# EAGLE design scheme (EAGLE 6.5.0)
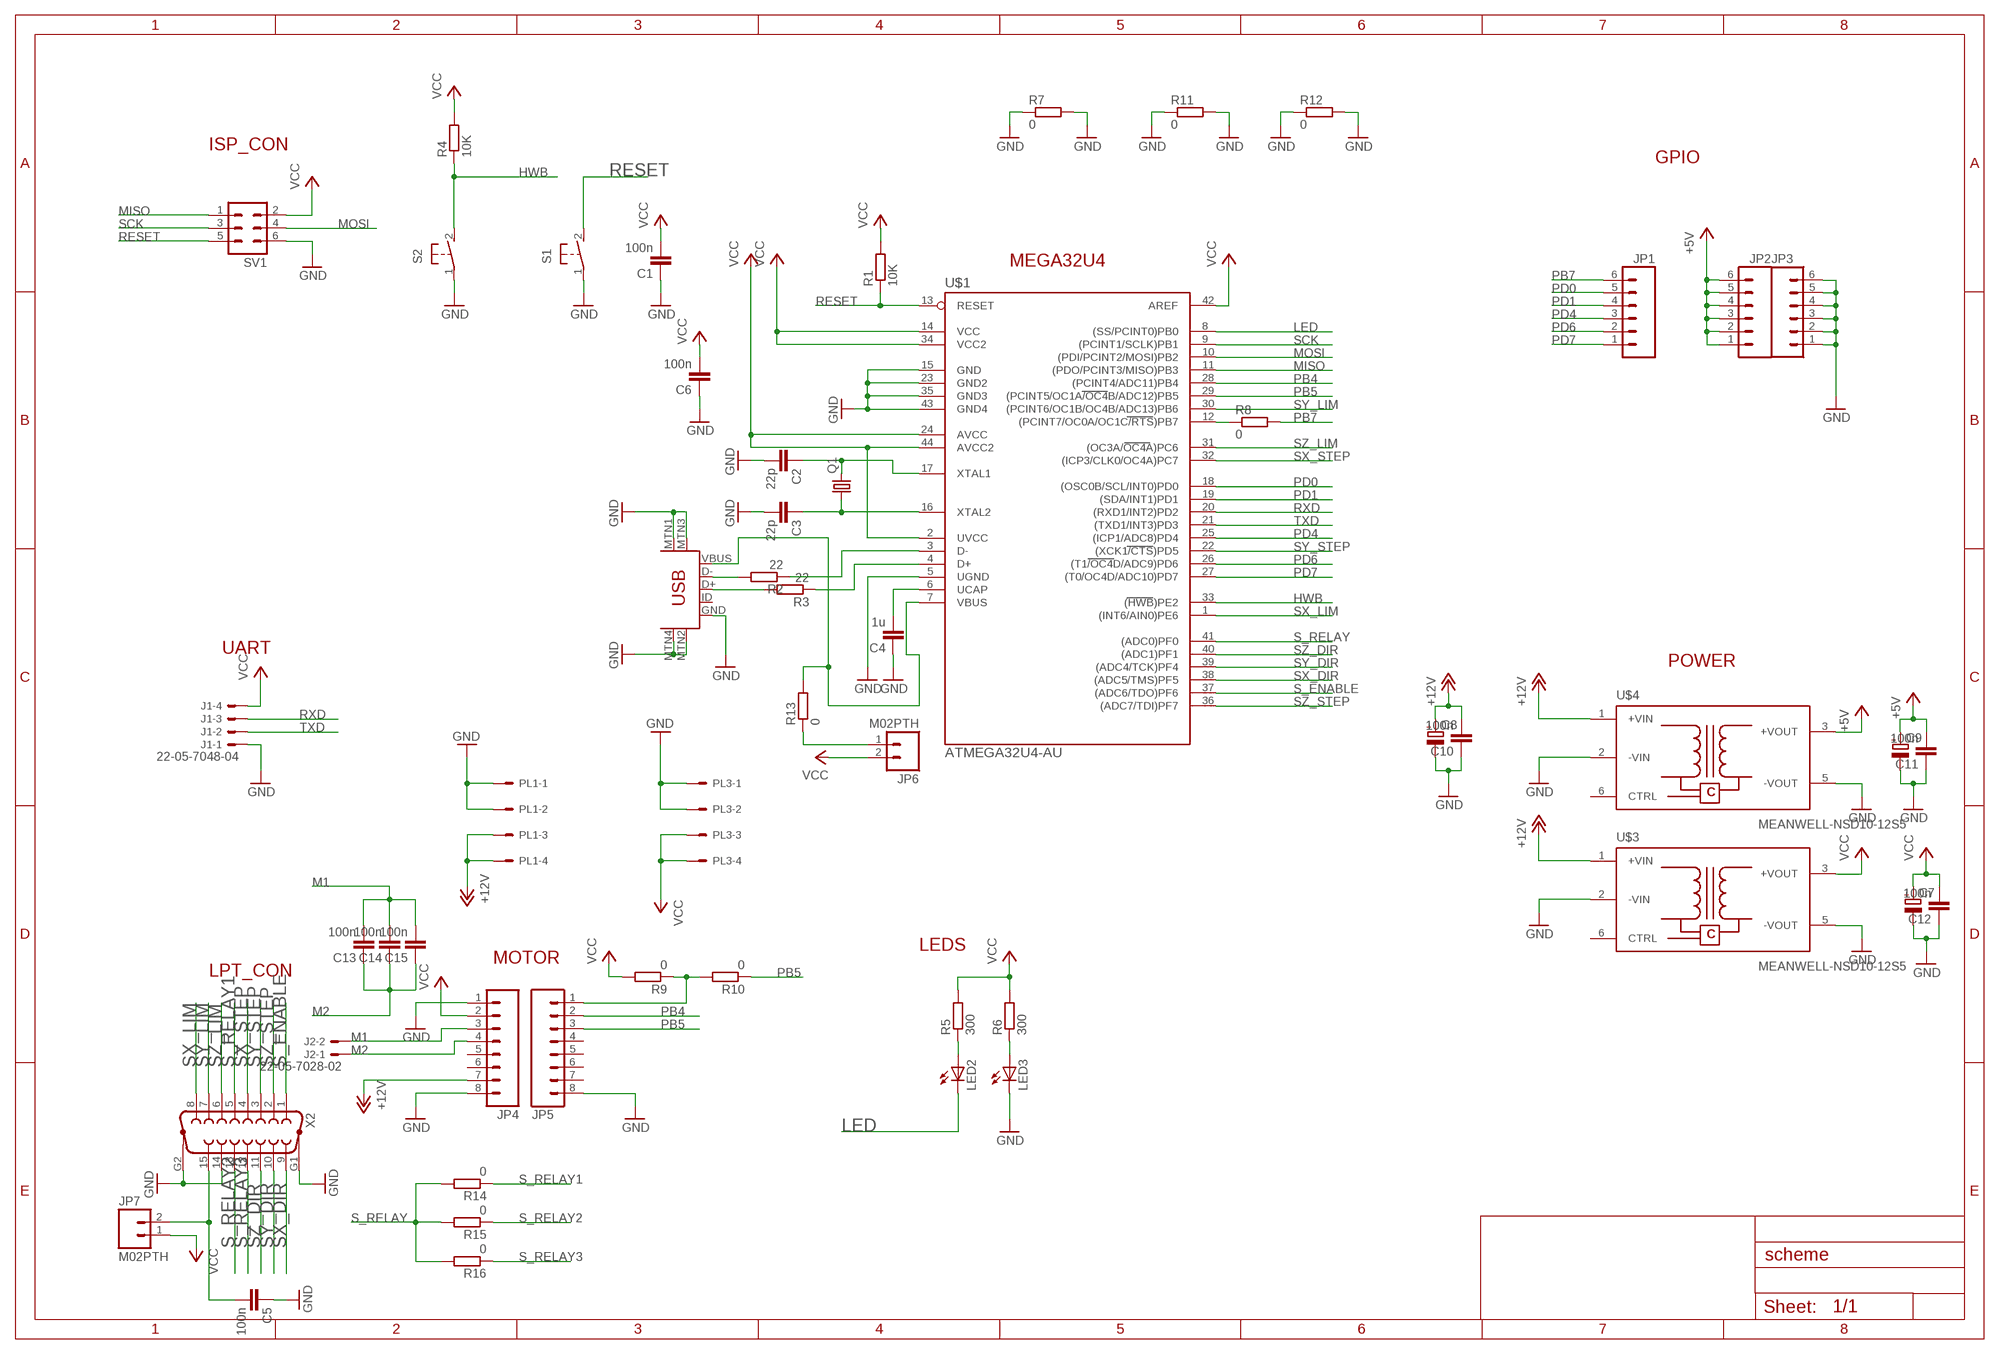
[diagram p0: schematic, sheet 1]

## Parts
C1  100n  C-EUC0805  [C0805]
C2  22p  C-EUC0805  [C0805]
C3  22p  C-EUC0805  [C0805]
C4  1u  C-EUC0805  [C0805]
C5  100n  C-EUC0805  [C0805]
C6  100n  C-EUC0805  [C0805]
C7  CPOL-EUE2.5-6  [E2,5-6]
C8  CPOL-EUE2.5-6  [E2,5-6]
C9  CPOL-EUE2.5-6  [E2,5-6]
C10  100n  C-EUC0805  [C0805]
C11  100n  C-EUC0805  [C0805]
C12  100n  C-EUC0805  [C0805]
C13  100n  C-EUC0805  [C0805]
C14  100n  C-EUC0805  [C0805]
C15  100n  C-EUC0805  [C0805]
J1  22-05-7048-04  [7395-04]
J2  22-05-7028-02  [7395-02]
JP1  M06SIP  [1X06]
JP2  M06SIP  [1X06]
JP3  M06SIP  [1X06]
JP4  M081X08  [1X08]
JP5  M081X08  [1X08]
JP6  M02PTH  [1X02]
JP7  M02PTH  [1X02]
LED2  LED5MM  [LED5MM]
LED3  LED5MM  [LED5MM]
PL1  555X-4H  [5569-4]
PL3  555X-4H  [5569-4]
Q1  CRYSTALHC49S  [HC49/S]
R1  10K  R-EU_R0805  [R0805]
R2  22  R-EU_R0805  [R0805]
R3  22  R-EU_R0805  [R0805]
R4  10K  R-EU_R0805  [R0805]
R5  300  R-EU_R0805  [R0805]
R6  300  R-EU_R0805  [R0805]
R7  0  R-EU_R1206  [R1206]
R8  0  R-EU_R1206  [R1206]
R9  0  R-EU_R0805  [R0805]
R10  0  R-EU_R0805  [R0805]
R11  0  R-EU_R1206  [R1206]
R12  0  R-EU_R1206  [R1206]
R13  0  R-EU_R1206  [R1206]
R14  0  R-EU_R0805  [R0805]
R15  0  R-EU_R0805  [R0805]
R16  0  R-EU_R0805  [R0805]
S1  31-XX  [B3F-31XX]
S2  31-XX  [B3F-31XX]
SV1  ML6L  [ML6L]
U$1  ATMEGA32U4-AU  [TQFP44]
U$2  USB-MINIB-5PIN  [USB-MINIB]
U$3  MEANWELL-NSD10-12S5  [POWER6-10W]
U$4  MEANWELL-NSD10-12S5  [POWER6-10W]
X2  F15HP  [F15HP]

## Nets
+5V: C9.+ C11.2 JP2.1 JP2.2 JP2.3 JP2.4 JP2.5 JP2.6 U$4.3(+VOUT)
+12V: C8.+ C10.2 JP4.7 PL1.3 PL1.4 U$3.1(+VIN) U$4.1(+VIN)
GND: C1.1 C2.2 C3.2 C4.1 C5.1 C6.1 C7.- C8.- C9.- C10.1 C11.1 C12.1 J1.1 JP3.1 JP3.2 JP3.3 JP3.4 JP3.5 JP3.6 JP4.1 JP4.8 JP5.8 LED3.K(C) PL1.1 PL1.2 PL3.1 PL3.2 R7.1 R7.2 R11.1 R11.2 R12.1 R12.2 S1.1(P) S2.1(P) SV1.6 U$1.5(UGND) U$1.15(GND) U$1.23(GND2) U$1.35(GND3) U$1.43(GND4) U$2.GND U$2.MTN1(MTN2) U$2.MTN2(MTN3) U$2.MTN3(MTN1) U$2.MTN4 U$3.2(-VIN) U$3.5(-VOUT) U$4.2(-VIN) U$4.5(-VOUT) X2.14 X2.G1 X2.G2
HWB: R4.1 S2.2(S) U$1.33((HWB)PE2)
LED: LED2.K(C) U$1.8((SS/PCINT0)PB0)
M1: C13.2 C14.2 C15.2 J2.2 JP4.3
M2: C13.1 C14.1 C15.1 J2.1 JP4.4
MISO: SV1.1 U$1.11((PDO/PCINT3/MISO)PB3)
MOSI: SV1.4 U$1.10((PDI/PCINT2/MOSI)PB2)
N$1: C3.1 Q1.1 U$1.16(XTAL2)
N$2: C2.1 Q1.2 U$1.17(XTAL1)
N$3: LED3.A R6.1
N$4: R3.2 U$2.D+
N$5: R8.1 U$1.12((PCINT7/OC0A/OC1C/RTS)PB7)
N$6: R2.2 U$2.D-
N$7: R2.1 U$1.3(D-)
N$8: R3.1 U$1.4(D+)
N$10: C4.2 U$1.6(UCAP)
N$11: R13.2 U$1.7(VBUS) U$2.VBUS
N$12: JP6.1 R13.1
N$13: LED2.A R5.1
N$16: C5.2 JP7.2 X2.15
N$17: JP5.1 R9.1 R10.2
PB4: JP5.2 U$1.28((PCINT4/ADC11)PB4)
PB5: JP5.3 R10.1 U$1.29((PCINT5/OC1A/OC4B/ADC12)PB5)
PB7: JP1.6 R8.2
PD0: JP1.5 U$1.18((OSC0B/SCL/INT0)PD0)
PD1: JP1.4 U$1.19((SDA/INT1)PD1)
PD4: JP1.3 U$1.25((ICP1/ADC8)PD4)
PD6: JP1.2 U$1.26((T1/OC4D/ADC9)PD6)
PD7: JP1.1 U$1.27((T0/OC4D/ADC10)PD7)
RESET: R1.1 S1.2(S) SV1.5 U$1.13(RESET)
RXD: J1.3 U$1.20((RXD1/INT2)PD2)
S_ENABLE: U$1.37((ADC6/TDO)PF6) X2.1
S_RELAY: R14.2 R15.2 R16.2 U$1.41((ADC0)PF0)
S_RELAY1: R14.1 X2.5
S_RELAY2: R15.1 X2.13
S_RELAY3: R16.1 X2.12
SCK: SV1.3 U$1.9((PCINT1/SCLK)PB1)
SX_DIR: U$1.38((ADC5/TMS)PF5) X2.9
SX_LIM: U$1.1((INT6/AIN0)PE6) X2.8
SX_STEP: U$1.32((ICP3/CLK0/OC4A)PC7) X2.4
SY_DIR: U$1.39((ADC4/TCK)PF4) X2.10
SY_LIM: U$1.30((PCINT6/OC1B/OC4B/ADC13)PB6) X2.7
SY_STEP: U$1.22((XCK1/CTS)PD5) X2.3
SZ_DIR: U$1.40((ADC1)PF1) X2.11
SZ_LIM: U$1.31((OC3A/OC4A)PC6) X2.6
SZ_STEP: U$1.36((ADC7/TDI)PF7) X2.2
TXD: J1.2 U$1.21((TXD1/INT3)PD3)
VCC: C1.2 C6.2 C7.+ C12.2 J1.4 JP4.2 JP6.2 JP7.1 PL3.3 PL3.4 R1.2 R4.2 R5.2 R6.2 R9.2 SV1.2 U$1.2(UVCC) U$1.14(VCC) U$1.24(AVCC) U$1.34(VCC2) U$1.42(AREF) U$1.44(AVCC2) U$3.3(+VOUT)
Unconnected: JP4.5 JP4.6 JP5.4 JP5.5 JP5.6 JP5.7 U$2.ID U$3.6(CTRL) U$4.6(CTRL)

## Notes on the sheet
- ISP_CON
- GPIO
- MEGA32U4
- UART
- POWER
- LEDS
- MOTOR
- LPT_CON

## Library data of the parts
C1-C6 C10-C15 = resistor:C-EU: CAPACITOR, European symbol
C7-C9 = rcl:CPOL-EU: POLARIZED CAPACITOR, European symbol
J1 = con-molex:22-?-04: CONNECTOR wire to board 2.54 mm (.1 inch) pitch header; OC_FARNELL: unknown; OC_NEWARK: unknown
J2 = con-molex:22-?-02: CONNECTOR wire to board 2.54 mm (.1 inch) pitch header; OC_FARNELL: 9731601; OC_NEWARK: unknown
JP1-JP3 = SparkFun-Connectors:M06: Header 6 Standard 6-pin 0.1" header. Use with straight break away headers (SKU : PRT-00116), right angle break away headers (PRT-00553), swiss pins (PRT-00743), machine pins (PRT-00117), and female headers (PRT-00115). Molex polarized connector foot print use with SKU : PRT-08094 with associated crimp pins and housings. NOTES ON THE VARIANTS LOCK and LOCK_LONGPADS... This footprint was designed to help hold the alignment of a through-hole component (i.e. 6-pin header) while soldering it into place. You may notice that each hole has been shifted either up or down by 0.005 of an inch from it's more standard position (which is a perfectly straight line). This slight alteration caused the pins (the squares in the middle) to touch the edges of the holes. Because they are alternating, it causes a "brace" to hold the component in place. 0.005 has proven to be the perfect amount of "off-center" position when using our standard breakaway headers. Although looks a little odd when you look at the bare footprint, once you have a header in there, the alteration is very hard to notice. Also,if you push a header all the way into place, it is covered up entirely on the bottom side. This idea of altering the position of holes to aid alignment will be further integrated into the Sparkfun Library for other footprints. It can help hold any component with 3 or more connection pins.
JP4 JP5 = SparkFun-Connectors:M08: Header 8 Standard 8-pin 0.1" header. Use with straight break away headers (SKU : PRT-00116), right angle break away headers (PRT-00553), swiss pins (PRT-00743), machine pins (PRT-00117), and female headers (PRT-00115).
JP6 JP7 = SparkFun-Connectors:M02: Standard 2-pin 0.1" header. Use with - straight break away headers ( PRT-00116) - right angle break away headers (PRT-00553) - swiss pins (PRT-00743) - machine pins (PRT-00117) - female headers (PRT-00115) Molex polarized connector foot print use with: PRT-08233 with associated crimp pins and housings. 2.54_SCREWTERM for use with PRT-10571. 3.5mm Screw Terminal footprints for PRT-08084 5mm Screw Terminal footprints for use with PRT-08433
LED2 LED3 = SparkFun-LED:LED: LEDs Standard schematic elements and footprints for 5mm, 3mm, 1206, and 0603 sized LEDs. 5mm - Spark Fun Electronics SKU : COM-00529 (and others)
PL1 PL3 = con-molex-2:555X-4: Mini FIT connector 4 way
Q1 = adafruit:CRYSTAL: CRYSTAL; OC_FARNELL: 1667008; OC_NEWARK: unknown
R1-R6 R9 R10 R14-R16 = resistor:R-EU_: RESISTOR, European symbol
R7 R8 R11-R13 = rcl:R-EU_: RESISTOR, European symbol
S1 S2 = switch-omron:31-XX: OMRON SWITCH; MPN: B3F-3100; OC_FARNELL: 959704; OC_NEWARK: 36M3582
SV1 = con-ml:ML6L: HARTING; OC_FARNELL: unknown; OC_NEWARK: unknown
U$1 = mega32U4:ATMEGA32U4-AU
U$2 = SparkFun-Connectors:USB-MINIB: Mini-USB "B" connector with 5th pin broken out. Created new symbol breaking out 5th "ID" pin in mini/micro USB connector spec. See: http://en.wikipedia.org/wiki/Mini_usb#Cables. Uses same footprint as 4-pin symbol. Also added pins to connect to mounting / shield pads if required (probably not generally needed as signals aren't shielded once they leave the connector).
U$3 U$4 = dimrobotics:MEANWELL-NSD10-
X2 = con-subd:F15HP: SUB-D; OC_FARNELL: unknown; OC_NEWARK: unknown

## Board
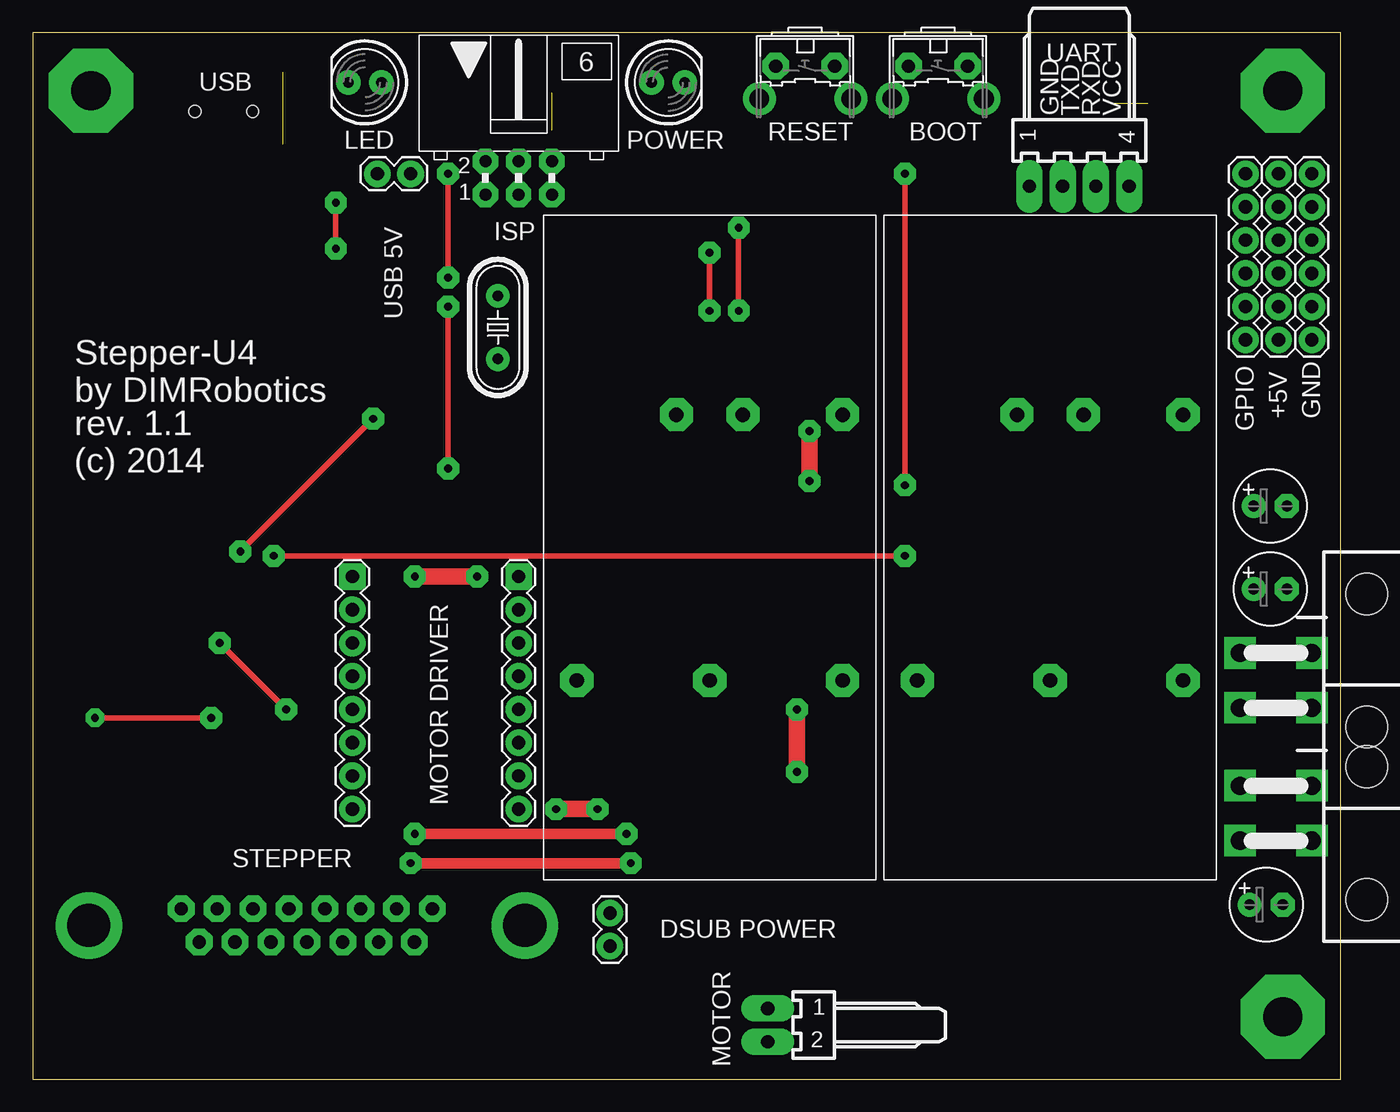
[diagram p1: board, top side]
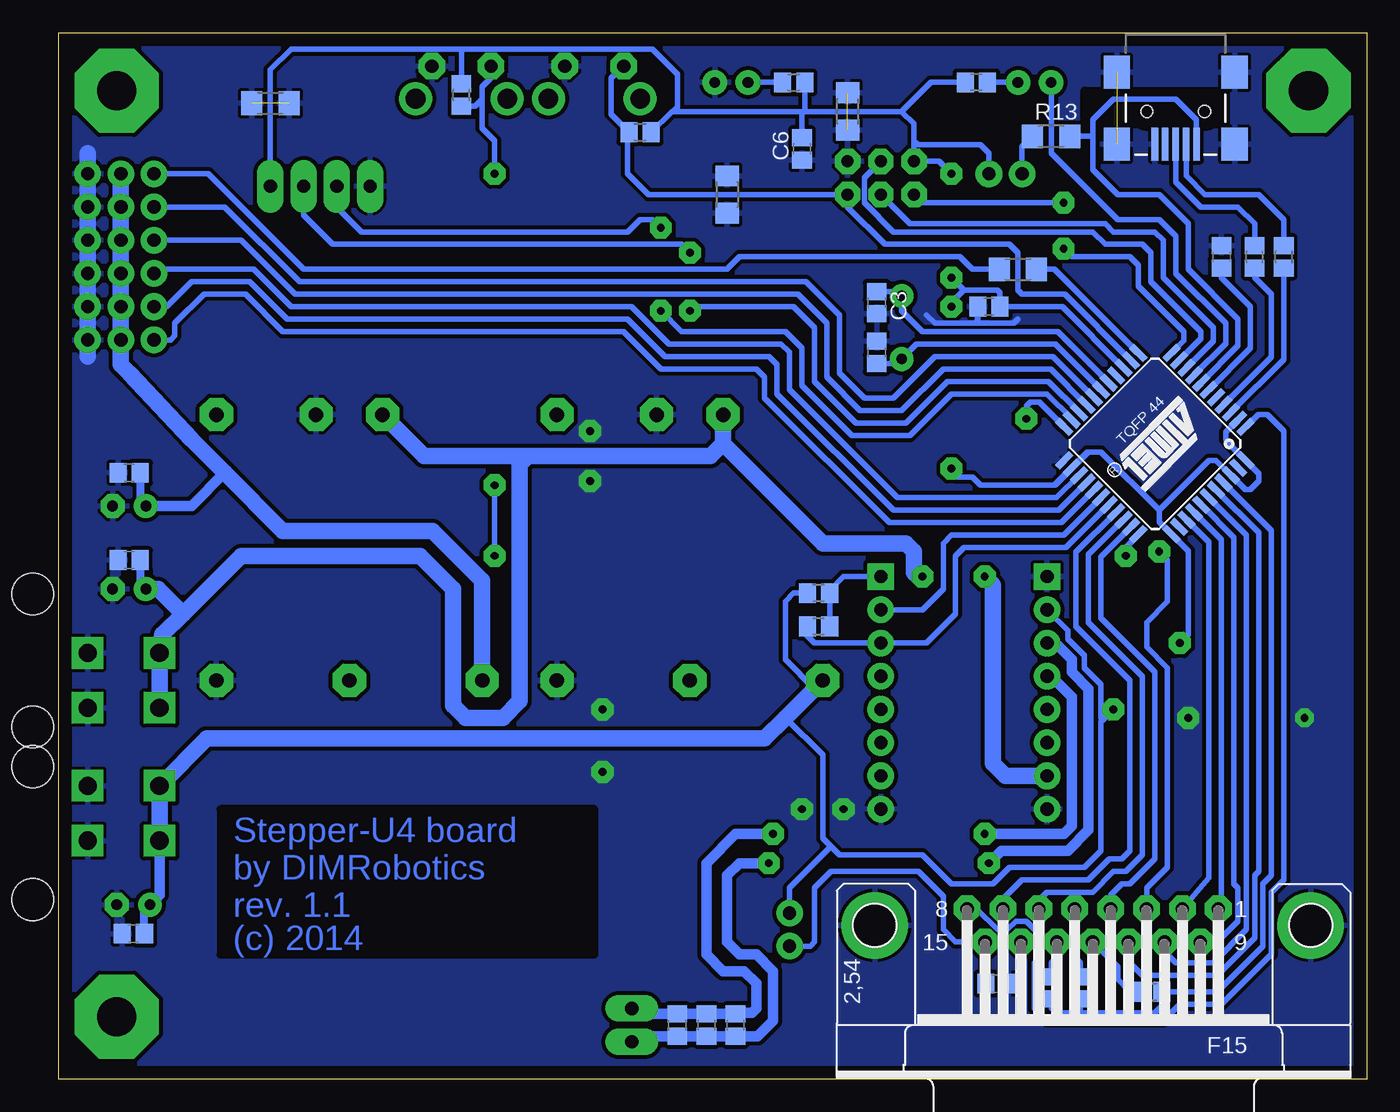
[diagram p2: board, bottom side, seen from below]

Size 100 x 80 mm. Coordinates in mm from the lower left corner, seen from the top.
Outline: 0,0 100,0 100,80 0,80 0,0
Copper layers (1*16): Top 0.035mm / dielectric 1.5mm / Bottom 0.035mm
Design rules "default *": minimum track width 10mil, minimum drill 24mil, track to track 8mil, track to pad 8mil, pad to pad 8mil, via to via 8mil, smd to smd 8mil, copper to edge 40mil, drill to drill 8mil, minimum pad ring 20mil, minimum via ring 8mil, stop-mask expansion 4mil, vias tented up to drill 0mil, thermal gap 10mil
bRestrict: 8 lines

### Footprints (pad centres in the part's own frame; a part is rotated, then mirrored left to right if it is on the bottom)
C0805 = smd 1.3 x 1.5: 1 -0.85,0; 2 0.85,0
E2,5-6 = drill 0.813 pad 1.6: + -1.27,0 | drill 0.813 pad 1.6 octagon: - 1.27,0
7395-04 = drill 1.016 long: 1 3.81,0; 2 1.27,0; 3 -1.27,0; 4 -3.81,0
7395-02 = drill 1.016 long: 1 1.27,0; 2 -1.27,0
1X06 = drill 1.016 pad 1.88: 1 0,0; 2 2.54,0; 3 5.08,0; 4 7.62,0; 5 10.16,0; 6 12.7,0
1X08 = drill 1.016 pad 1.88 square: 1 0,0 | drill 1.016 pad 1.88: 2 2.54,0; 3 5.08,0; 4 7.62,0; 5 10.16,0; 6 12.7,0; 7 15.24,0; 8 17.78,0
1X02 = drill 1.016 pad 1.88: 1 0,0; 2 2.54,0
LED5MM = drill 0.813 pad 1.88: A -1.27,0; K 1.27,0
5569-4 = drill 1.4 square: 1 2.1,0; 2 -2.1,0; 3 2.1,5.5; 4 -2.1,5.5 | hole 3.2: 6.6,-4.2; -6.6,-4.2
HC49/S = drill 0.813: 1 -2.413,0; 2 2.413,0
R0805 = smd 1.3 x 1.5: 1 -0.85,0; 2 0.85,0
R1206 = smd 1.6 x 1.803: 1 -1.422,0; 2 1.422,0
B3F-31XX = drill 1.016 octagon: 1 -2.261,-1.245; 2 2.261,-1.245 | drill 1.499 pad 2.159: 3 -3.505,1.245; 4 3.505,1.245
ML6L = drill 0.914 octagon: 1 -2.54,-1.27; 2 -2.54,1.27; 3 0,-1.27; 4 0,1.27; 5 2.54,-1.27; 6 2.54,1.27
TQFP44 = smd 1.5 x 0.5: 1 -5.8,4; 2 -5.8,3.2; 3 -5.8,2.4; 4 -5.8,1.6; 5 -5.8,0.8; 6 -5.8,0; 7 -5.8,-0.8; 8 -5.8,-1.6; 9 -5.8,-2.4; 10 -5.8,-3.2; 11 -5.8,-4; 23 5.8,-4; 24 5.8,-3.2; 25 5.8,-2.4; 26 5.8,-1.6; 27 5.8,-0.8; 28 5.8,0; 29 5.8,0.8; 30 5.8,1.6; 31 5.8,2.4; 32 5.8,3.2; 33 5.8,4 | smd 0.5 x 1.5: 12 -4,-5.8; 13 -3.2,-5.8; 14 -2.4,-5.8; 15 -1.6,-5.8; 16 -0.8,-5.8; 17 0,-5.8; 18 0.8,-5.8; 19 1.6,-5.8; 20 2.4,-5.8; 21 3.2,-5.8; 22 4,-5.8; 34 4,5.8; 35 3.2,5.8; 36 2.4,5.8; 37 1.6,5.8; 38 0.8,5.8; 39 0,5.8; 40 -0.8,5.8; 41 -1.6,5.8; 42 -2.4,5.8; 43 -3.2,5.8; 44 -4,5.8
USB-MINIB = smd 2.5 x 0.5: D+ 2.5,0; D- 2.5,0.8; GND 2.5,-1.6; ID 2.5,-0.8; VBUS 2.5,1.6 | smd 2.5 x 2: MTN1 -3,4.5; MTN2 2.5,4.5; MTN3 -3,-4.5; MTN4 2.5,-4.5 | hole 0.9: 0,2.2; 0,-2.2
POWER6-10W = drill 1.1 pad 2.54 octagon: 1 10.16,2.54; 2 10.16,-2.54; 3 -10.16,10.16; 4 -10.16,0; 5 -10.16,-10.16; 6 10.16,-10.16
F15HP = drill 1.016 octagon: 1 -9.601,-1.27; 2 -6.858,-1.27; 3 -4.115,-1.27; 4 -1.372,-1.27; 5 1.372,-1.27; 6 4.115,-1.27; 7 6.858,-1.27; 8 9.601,-1.27; 9 -8.23,1.27; 10 -5.486,1.27; 11 -2.743,1.27; 12 0,1.27; 13 2.743,1.27; 14 5.486,1.27; 15 8.23,1.27 | drill 3.302 pad 5.08: G1 -16.662,0; G2 16.662,0

### Placement (x,y rotation side)
C1  28.89,59.05 0 bottom
C2  37.47,55.56 90 bottom
C3  37.47,59.37 270 bottom
C4  11.11,62.87 270 bottom
C5  28.26,7.3 180 bottom
C6  43.18,71.12 90 bottom
C7  94.3,13.34 0 top
C8  94.61,37.47 0 top
C9  94.61,43.81 0 top
C10  94.61,39.69 0 bottom
C11  94.61,46.35 0 bottom
C12  94.3,11.11 0 bottom
C13  52.7,4.13 270 bottom
C14  50.48,4.13 270 bottom
C15  48.26,4.13 270 bottom
J1  80.01,68.26 180 top
J2  56.2,4.13 90 top
JP1  92.71,56.52 90 top
JP2  95.25,69.22 270 top
JP3  97.79,69.22 270 top
JP4  24.45,38.42 270 top
JP5  37.15,38.42 270 top
JP6  26.35,69.22 0 top
JP7  44.13,12.7 270 top
LED2  25.4,76.2 180 top
LED3  48.58,76.2 0 top
PL1  97.79,30.48 90 top
PL3  97.79,20.32 90 top
Q1  35.56,57.47 270 top
R1  55.56,72.39 0 bottom
R2  6.35,62.87 90 bottom
R3  8.57,62.87 90 bottom
R4  69.22,75.25 90 bottom
R5  29.84,76.2 180 bottom
R6  43.81,76.2 0 bottom
R7  39.69,73.98 270 bottom
R8  26.67,61.91 180 bottom
R9  41.91,37.15 180 bottom
R10  41.91,34.61 0 bottom
R11  83.82,74.61 180 bottom
R12  48.9,67.63 90 bottom
R13  24.13,72.07 0 bottom
R14  21.91,6.99 270 bottom
R15  24.13,6.99 270 bottom
R16  16.51,6.67 0 bottom
S1  59.05,76.2 180 top
S2  69.22,76.2 180 top
SV1  37.15,68.9 0 top
U$1  16.19,48.58 225 bottom
U$2  14.61,73.98 270 bottom
U$3  51.75,40.64 90 top
U$4  77.79,40.64 90 top
X2  20.95,11.75 180 bottom

### Tracks (layer width: path | path; a pad name or v marks a point on that pad's centre or on a via)
+5V
  Bottom 0.61: C11.2 93.77,44.23 C9.+
  Bottom 0.813: 95.25,69.85 JP2.1 | C9.+ 89.85,43.81 87.31,46.35
  Bottom 1.27: JP2.1 JP2.2 JP2.3 JP2.4 JP2.5 JP2.6 95.25,54.61 94.61,53.98 89.85,48.9 87.31,46.35 82.87,41.91 71.44,41.91 67.63,38.1 U$4.3
+12V  (via drill 0.6 pad 1.68)
  Top 1.27: v29.21,38.42 v33.97,38.42
  Bottom 0.61: C10.2 93.77,37.88 C8.+
  Bottom 1.27: 49.21,48.58 50.16,47.62 64.14,47.62 | 64.14,47.62 72.07,47.62 U$4.1 | 64.14,47.62 64.77,46.99 64.77,28.89 66.04,27.62 68.9,27.62 69.85,28.57 69.85,37.47 72.39,40.01 86.04,40.01 90.49,35.56 | JP4.7 27.62,23.18 28.57,24.13 28.57,37.78 v29.21,38.42 | v33.97,38.42 34.29,38.42 34.61,38.73 34.61,40.32 35.24,40.96 41.59,40.96 49.21,48.58 | 49.21,48.58 U$3.1 | 90.49,35.56 92.08,33.97 92.08,32.8 PL1.3 PL1.4 | C8.+ 92.39,37.47 90.49,35.56
GND  (via drill 0.6 pad 1.42, 0.6 pad 1.68)  (3 unrouted)
  Top 0.406: v13.65,27.62 v4.76,27.62
  Top 1.27: v59.37,49.53 v59.37,45.72 | v58.42,28.26 v58.42,23.5 | v40.01,20.64 v43.18,20.64
  Bottom 0.406: C1.1 29.74,58.32 | 29.74,58.32 29.84,57.78 | 29.84,57.78 26.99,57.78 26.67,58.1 | 29.74,58.32 29.74,57.89 29.84,57.78 | 29.84,57.78 33.02,57.78 33.66,58.42
  Bottom 1.27: 97.79,55.24 97.79,70.8
  pour Bottom (isolate 0.305): 0,80.01 100.01,80.01 100.01,0 0,0
HWB  (via drill 0.6 pad 1.68)
  Top 0.406: v66.67,69.22 v66.67,45.4 | v66.67,40.01 v18.41,40.01
  Bottom 0.406: S2.2 66.95,76.56 67.63,75.88 67.63,74.93 | 67.63,74.93 68.16,74.4 R4.1 | 67.63,74.93 67.63,72.71 66.67,71.75 v66.67,69.22 | v66.67,45.4 v66.67,40.01 | 18.41,40.38 v18.41,40.01 18.41,40.64 17.46,41.59 U$1.33
LED
  Bottom 0.406: U$1.8 10.79,56.24 10.79,57.78 14.61,61.59 14.61,64.45 15.88,65.72 19.05,65.72 24.13,70.8 LED2.K
M1  (via drill 0.6 pad 1.68)
  Top 0.813: v28.89,16.51 v45.72,16.51
  Bottom 0.813: JP4.3 23.81,33.34 22.54,32.07 22.54,31.11 21.27,29.84 21.27,19.05 22.86,17.46 27.94,17.46 v28.89,16.51 | v45.72,16.51 47.94,16.51 48.9,15.56 48.9,10.48 47.94,9.53 46.67,9.53 45.4,8.26 45.4,4.45 46.57,3.28 C15.2 C14.2 C13.2 54.51,3.28 54.93,2.86 J2.2
M2  (via drill 0.6 pad 1.68)
  Top 0.813: v29.21,18.73 v45.4,18.73
  Bottom 0.813: v45.4,18.73 48.26,18.73 50.48,16.51 50.48,9.53 49.21,8.26 47.62,8.26 46.67,7.3 46.67,5.4 46.99,5.08 48.16,5.08 C15.1 C14.1 C13.1 55.78,4.98 J2.1 55.88,5.71 | v29.21,18.73 23.18,18.73 22.54,19.37 22.54,29.21 24.13,30.8 JP4.4
MISO  (via drill 0.6 pad 1.68)
  Top 0.406: v23.18,63.5 v23.18,66.99
  Bottom 0.406: v23.18,63.5 22.54,62.87 18.1,62.87 17.46,62.23 17.46,60.64 13.97,57.15 13.97,56.46 U$1.11 | v23.18,66.99 33.97,66.99 SV1.1
MOSI
  Bottom 0.406: SV1.4 38.42,68.9 38.42,66.99 36.2,64.77 20.95,64.77 20,63.82 17.14,63.82 16.51,63.18 16.51,60.96 12.7,57.15 12.7,56.59 U$1.10
N$1
  Bottom 0.406: U$1.16 23.63,57.15 33.97,57.15 35.56,58.74 Q1.1 35.9,60.22 C3.1
N$2
  Bottom 0.406: U$1.17 23.81,56.2 34.42,56.2 Q1.2 35.9,54.71 C2.1
N$3
  Bottom 0.406: R6.1 LED3.A
N$4
  Bottom 0.406: U$2.D+ 14.61,68.58 12.7,66.67 9.84,66.67 8.57,65.41 R3.2
N$5
  Bottom 0.406: U$1.12 23.87,61.91 R8.1
N$6
  Bottom 0.406: U$2.D- 13.8,69.05 12.38,67.63 8.26,67.63 6.35,65.72 R2.2
N$7
  Bottom 0.406: U$1.3 6.35,55.03 R2.1
N$8
  Bottom 0.406: U$1.4 7.3,55.2 7.3,60.01 8.57,61.28 R3.1
N$9  (via drill 3 pad 6.45)
  other vias: 4.45,75.56
N$10
  Bottom 0.406: U$1.6 8.89,55.88 8.89,59.05 11.11,61.28 C4.2
N$11
  Bottom 0.406: U$2.VBUS 13.02,73.34 14.61,74.93 19.37,74.93 20.95,73.34 20.95,72.07 | 20.95,72.07 20.95,69.53 19.05,67.63 15.88,67.63 13.65,65.41 13.65,61.91 9.84,58.1 9.84,56.06 U$1.7 | R13.2 20.95,72.07
N$12
  Bottom 0.406: JP6.1 26.35,71.27 R13.1
N$13
  Bottom 0.406: LED2.A R5.1
N$14  (via drill 3 pad 6.45)
  other vias: 95.57,75.56
N$15  (via drill 3 pad 6.45)
  other vias: 95.57,4.76
N$16
  Bottom 0.406: JP7.2 42.55,10.16 42.23,10.48 42.23,14.61 40.96,15.88 34.29,15.88 32.38,13.97 32.38,11.43 31.43,10.48 X2.15 29.18,7.38 C5.2
N$17
  Bottom 0.406: JP5.1 40.01,38.42 41.06,37.36 R9.1 R10.2
PB4
  Bottom 0.406: U$1.28 23.18,41.59 31.75,41.59 32.38,40.96 32.38,37.47 33.97,35.88 JP5.2
PB5
  Bottom 0.406: U$1.29 23,40.64 30.8,40.64 31.43,40.01 31.43,35.56 33.66,33.34 JP5.3 42.23,33.34 42.86,33.97 42.86,34.51 R10.1
PB7
  Bottom 0.406: R8.2 30.16,61.91 31.11,62.87 47.94,62.87 48.9,61.91 81.28,61.91 88.58,69.22 JP1.6
PD0
  Bottom 0.406: U$1.18 23.99,55.24 33.02,55.24 36.2,52.07 38.42,52.07 40.32,53.98 40.32,58.42 42.86,60.96 81.6,60.96 87.31,66.67 JP1.5
PD1
  Bottom 0.406: U$1.19 24.17,54.29 32.38,54.29 35.56,51.12 38.73,51.12 41.27,53.66 41.27,57.78 43.5,60.01 81.92,60.01 86.04,64.14 JP1.4
PD4
  Bottom 0.406: U$1.25 23.71,44.45 35.88,44.45 44.13,52.7 44.13,55.56 44.77,56.2 53.34,56.2 56.2,59.05 82.23,59.05 85.09,61.91 92.39,61.91 JP1.3
PD6
  Bottom 0.406: U$1.26 23.54,43.5 36.2,43.5 45.09,52.39 45.09,54.61 45.72,55.24 53.66,55.24 56.52,58.1 82.55,58.1 85.41,60.96 89.85,60.96 91.76,59.05 JP1.2
PD7
  Bottom 0.406: U$1.27 23.36,42.55 36.51,42.55 46.04,52.07 46.04,53.66 46.67,54.29 53.98,54.29 56.83,57.15 82.87,57.15 85.72,60.01 88.9,60.01 91.12,57.78 91.12,56.83 91.44,56.52 JP1.1
RESET
  Bottom 0.406: S1.2 56.86,77.44 57.78,76.52 57.78,73.76 R1.1 56.52,72.29 56.52,69.22 54.93,67.63 SV1.5 39.69,66.67 36.83,63.82 27.3,63.82 26.67,63.18 26.67,60.33 26.35,60.01 23.1,60.01 U$1.13
RXD  (via drill 0.6 pad 1.68)
  Top 0.406: v51.75,58.74 v51.75,63.18
  Bottom 0.406: U$1.20 24.35,53.34 32.07,53.34 35.24,50.16 39.05,50.16 42.23,53.34 42.23,57.47 43.81,59.05 51.44,59.05 v51.75,58.74 | v51.75,63.18 52.39,63.82 79.06,63.82 81.28,66.04 J1.3
S_ENABLE
  Bottom 0.406: U$1.37 11.11,41.23 11.11,13.41 X2.1
S_RELAY
  Bottom 0.406: U$1.41 7.3,41.95 7.3,15.56 7.94,14.92 7.94,10.16 11.43,6.67 R16.2 15.66,5.61 16.19,5.08 21.91,5.08 | 21.91,5.08 23.81,5.08 24.13,5.4 R15.2 | R14.2 21.91,5.08
S_RELAY1
  Bottom 0.406: X2.5 22.33,9.31 21.91,8.89 R14.1
S_RELAY2
  Bottom 0.406: X2.13 23.7,9.32 24.13,8.89 R15.1
S_RELAY3
  Bottom 0.406: R16.1 18.1,6.67 19.05,7.62 19.05,8.57 X2.12
SCK
  Bottom 0.406: SV1.3 34.92,65.41 20,65.41 19.37,64.77 16.19,64.77 15.56,64.14 15.56,61.28 11.75,57.47 11.75,56.42 U$1.9
SX_DIR
  Bottom 0.406: U$1.38 10.16,41.41 10.16,14.92 9.84,14.61 9.84,12.06 11.43,10.48 X2.9
SX_LIM
  Bottom 0.406: U$1.1 8.31,50.8 7.62,50.8 6.35,49.53 6.35,15.24 7.3,14.29 7.3,9.53 11.11,5.71 14.29,5.71 15.56,4.45 24.45,4.45 25.4,5.4 25.4,8.89 25.08,9.21 25.08,11.11 26.04,12.06 26.83,12.06 27.46,11.43 28.26,11.43 29.84,13.02 X2.8
SX_STEP
  Bottom 0.406: U$1.32 20.32,39.92 20.32,35.24 16.19,31.11 16.19,16.83 18.1,14.92 18.73,14.92 19.58,14.07 X2.4
SY_DIR
  Bottom 0.406: U$1.39 9.21,41.59 9.21,11.43 11.75,8.89 14.61,8.89 15.47,9.75 X2.10
SY_LIM
  Bottom 0.406: U$1.30 22.23,40.28 22.23,34.61 18.1,30.48 18.1,17.46 18.73,16.83 19.68,16.83 21.27,15.24 26.35,15.24 27.81,13.78 X2.7
SY_STEP  (via drill 0.6 pad 1.68)
  Top 0.406: v26.04,50.48 v15.88,40.32
  Bottom 0.406: U$1.22 25.02,51.75 25.72,51.75 26.04,51.44 v26.04,50.48 | v15.88,40.32 15.24,39.69 15.24,36.51 16.83,34.92 16.83,33.02 15.24,31.43 15.24,16.19 16.83,14.61 16.83,13.03 X2.3
SZ_DIR
  Bottom 0.406: U$1.40 8.26,41.77 8.26,15.88 8.57,15.56 8.57,10.79 11.43,7.94 17.14,7.94 18.21,9 X2.11
SZ_LIM
  Bottom 0.406: U$1.31 21.27,40.1 21.27,34.92 17.14,30.8 17.14,17.14 18.41,15.88 19.37,15.88 20.95,14.29 24.45,14.29 25.08,13.65 25.08,13.03 X2.6
SZ_STEP
  Bottom 0.406: U$1.36 12.06,41.06 12.06,15.37 X2.2
TXD  (via drill 0.6 pad 1.68)
  Top 0.406: v53.98,58.74 v53.98,65.09
  Bottom 0.406: U$1.21 22.56,50.5 24.45,52.39 31.75,52.39 34.92,49.21 39.37,49.21 43.18,53.02 43.18,55.88 44.45,57.15 52.39,57.15 v53.98,58.74 | v53.98,65.09 54.61,65.72 55.56,65.72 56.52,64.77 76.83,64.77 78.74,66.67 J1.2
VCC  (via drill 0.6 pad 1.68)
  Top 0.406: v31.75,61.28 v31.75,69.22 | v31.75,46.67 v31.75,59.05 | v14.29,33.34 v19.37,28.26
  Bottom 0.406: 34.61,71.75 SV1.2 32.7,70.17 v31.75,69.22 | 34.61,71.75 34.61,73.03 35.56,73.98 | R5.2 33.34,76.2 35.56,73.98 | 35.56,73.98 42.86,73.98 | 42.86,73.98 43.18,73.98 | 43.18,73.98 53.02,73.98 | 53.02,73.98 53.12,73.98 R1.2 | R6.2 42.97,74.08 42.86,73.98 | 53.02,73.98 52.7,74.3 52.7,76.83 54.61,78.74 69.22,78.74 | 15.88,43.5 15.88,42.6 U$1.34 13.65,40.38 13.65,33.97 v14.29,33.34 | 15.88,43.5 12.06,47.31 11.53,47.31 U$1.42 9.31,45.09 8.89,45.09 8.26,45.72 8.26,46.3 U$1.44 10.54,48.58 10.79,48.9 10.79,49.45 U$1.2 | U$1.14 23.28,59.05 C1.2 28.04,60.11 28.26,60.33 30.8,60.33 | U$1.24 23.89,45.4 | 23.89,45.4 29.53,45.4 30.16,46.04 31.43,46.04 v31.75,46.67 | U$1.24 22.56,46.66 | 22.56,46.66 23.81,45.4 23.89,45.4 | 15.88,43.5 20.32,47.94 21.27,47.94 | 21.27,47.94 21.35,47.94 U$1.24 | 21.27,47.94 22.56,46.66 | 40.96,17.78 41.59,18.41 41.59,24.77 44.45,27.62 | 40.96,17.78 40.32,17.14 33.97,17.14 31.75,14.92 28.57,14.92 27.3,16.19 21.59,16.19 20.32,17.46 20.32,27.3 20.16,27.46 | R9.2 43.81,37.15 44.45,36.51 44.45,32.07 42.23,29.84 | 30.8,60.33 v31.75,61.28 | v31.75,59.05 31.75,59.37 30.8,60.33 | R4.2 69.22,78.74 | 69.22,78.74 82.23,78.74 83.82,77.15 J1.4 | JP4.2 22.86,34.29 22.86,33.66 21.59,32.38 21.59,31.43 20.32,30.16 20.32,27.62 20.16,27.46 | v19.37,28.26 20.16,27.46 | C6.2 43.18,73.98 | JP6.2 28.89,70.8 29.53,71.44 34.29,71.44 34.61,71.75 | JP7.1 44.13,14.61 40.96,17.78
  Bottom 0.61: C12.2 93.45,12.91 C7.+
  Bottom 0.813: PL3.4 92.29,14.07 C7.+
  Bottom 1.27: PL3.4 PL3.3 88.67,26.04 46.04,26.04 44.45,27.62 42.23,29.84 U$3.3

### Text on the board
Bottom: Stepper-U4 board | by DIMRobotics | rev. 1.1 | (c) 2014
tNames: UART | USB | GND | TXD | RXD | VCC | RESET | BOOT | LED | POWER | ISP | USB 5V | Stepper-U4 | by DIMRobotics | GPIO | +5V | GND | rev. 1.1 | (c) 2014 | MOTOR DRIVER | STEPPER | DSUB POWER | MOTOR